# Altium schematic sheet main.SchDoc
size A4
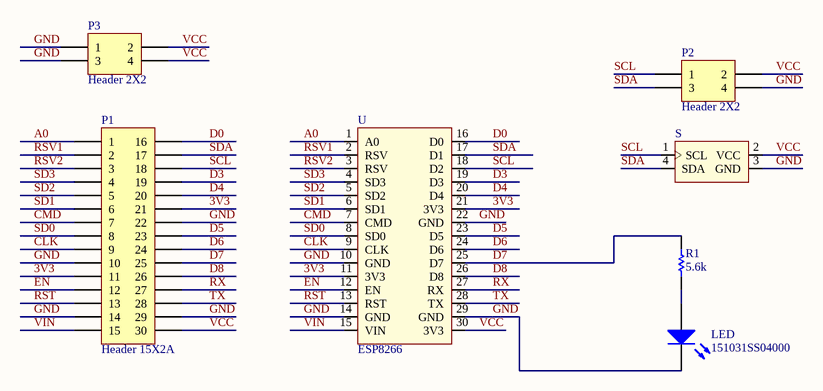
[diagram p0: main.SchDoc]

## Parts
LED  151031SS04000  [Type 3mm]
P1  Header 15X2A  [HDR2X15_CEN]
P2  Header 2X2  [HDR2X2]
P3  Header 2X2  [HDR2X2]
R1  5.6k  [RESC2013X70X40LL20T20]
S  (no value)  [To-5]
U  ESP8266  [NodeMCU ESP8266]

## Nets
3V3: P1.11 P1.21 U.11(3V3) U.21(3V3)
A0: P1.1 U.1(A0)
CLK: P1.9 U.9(CLK)
CMD: P1.7 U.7(CMD)
D0: P1.16 U.16(D0)
D3: P1.19 U.19(D3)
D4: P1.20 U.20(D4)
D5: P1.23 U.23(D5)
D6: P1.24 U.24(D6)
D7: P1.25 R1.1 U.25(D7)
D8: P1.26 U.26(D8)
EN: P1.12 U.12(EN)
GND: LED.1(K) P1.10 P1.14 P1.22 P1.29 P2.4 P3.1 P3.3 S.3(GND) U.10(GND) U.14(GND) U.22(GND) U.29(GND)
RST: P1.13 U.13(RST)
RSV1: P1.2 U.2(RSV)
RSV2: P1.3 U.3(RSV)
RX: P1.27 U.27(RX)
SCL: P1.18 P2.1 S.1(SCL) U.18(D2)
SD0: P1.8 U.8(SD0)
SD1: P1.6 U.6(SD1)
SD2: P1.5 U.5(SD2)
SD3: P1.4 U.4(SD3)
SDA: P1.17 P2.3 S.4(SDA) U.17(D1)
TX: P1.28 U.28(TX)
VCC: P1.30 P2.2 P3.2 P3.4 S.2(VCC) U.30(3V3)
VIN: P1.15 U.15(VIN)
NetLED_2: LED.2(A) R1.2

## Library data of the parts
LED = CMP-1488-00005-1: THT LED round mono-color color lens, WL-TMRW, Super Red; Manufacturer: Wuerth Elektronik; ComponentLink2Description: Datasheet; ComponentLink1URL: http://www.we-online.com; ComponentLink1Description: Manufacturer URL; PackageReference: Type 3mm; PartNumber: 151031SS04000; ComponentLink2URL: http://katalog.we-online.de/pbs/datasheet/7448042001.pdfhttp://katalog.we-online.de/pbs/datasheet/7448042001.pdfhttp://katalog.we-online.de/pbs/datasheet/7448042001.pdfhttp://katalog.we-online.de/pbs/datasheet/151031SS04000.pdf; Emitting color: Super Red
P1 = Header 15X2A: Header, 15-Pin, Dual row; LatestRevisionDate: 17-Jul-2002; LatestRevisionNote: Re-released for DXP Platform.; Publisher: Altium Limited
P2 P3 = Header 2X2: Header, 2-Pin, Dual row; LatestRevisionDate: 17-Jul-2002; LatestRevisionNote: Re-released for DXP Platform.; Publisher: Altium Limited
R1 = CMP-2001-00333-3: Chip Resistor, 0 Ohm, +/- 5%, 125 mW, -55 to 155 degC, 0805 (2012 Metric), RoHS, Tape and Reel; PartNumber: ERJ-6GEY0R00V; Manufacturer: Basic Passives; Power Rating: 125 mW; Case\/Package: 0805; Resistance: 0 Ohm; Voltage Rating: 150 V; Pins: 2; Mount: Surface Mount; ComponentLink2URL: http://industrial.panasonic.com/cdbs/www-data/pdf/RDA0000/AOA0000C84.pdf; Height: 0.6 mm; Max Operating Temperature: 155 degC; PackageDescription: 2-Pin Surface Mount Device, Body 2 x 1.25 mm; Min Operating Temperature: -55 degC; Width: 1.25 mm; Case Code (Metric): 2012; Radiation Hardening: No; PackageReference: 0805; ComponentLink2Description: Datasheet; Package Quantity: 5000; Packaging: Tape and Reel; ComponentLink1Description: Manufacturer URL; DatasheetVersion: 03/2015; Tolerance: 5%; RoHSCompliant: true; Mounting Technology: Surface Mount; Length: 2 mm; Case Code (Imperial): 0805; REACH SVHC: No SVHC; ComponentLink1URL: http://www.panasonic.com/; Value: 5.6k
S = TO-5
U = NodeMCU ESP8266